# EAGLE design mainboard (EAGLE 5.09)

## Sheet 1 of 3
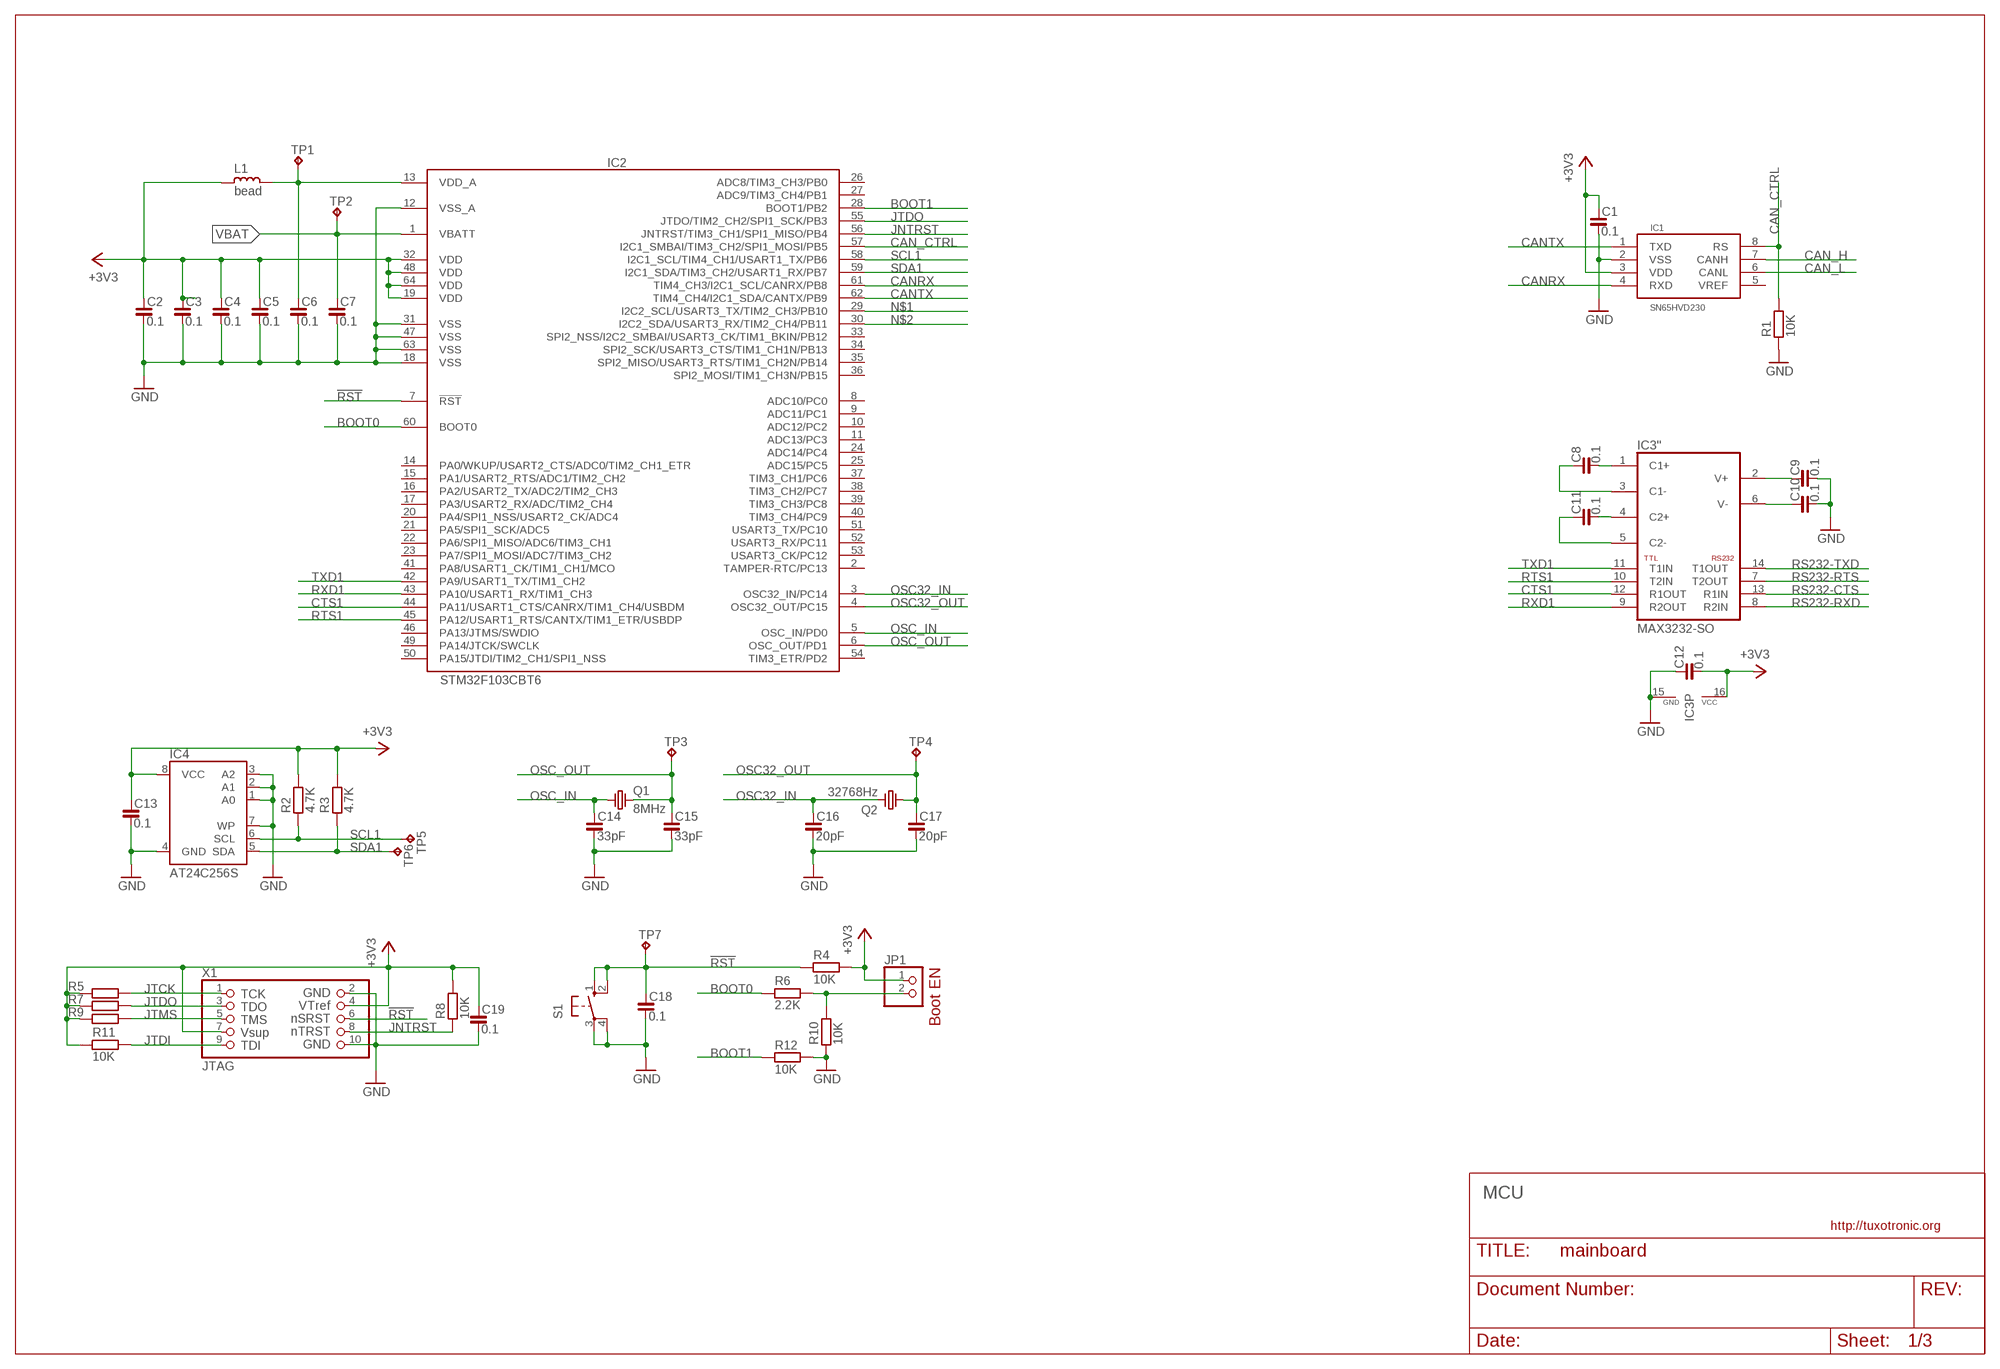
[diagram p0: schematic, sheet 1]

### Parts
C1  0.1  C_0603  [C0603]
C2  0.1  C_0603  [C0603]
C3  0.1  C_0603  [C0603]
C4  0.1  C_0603  [C0603]
C5  0.1  C_0603  [C0603]
C6  0.1  C_0603  [C0603]
C7  0.1  C_0603  [C0603]
C8  0.1  C_0603  [C0603]
C9  0.1  C_0603  [C0603]
C10  0.1  C_0603  [C0603]
C11  0.1  C_0603  [C0603]
C12  0.1  C_0603  [C0603]
C13  0.1  C_0603  [C0603]
C14  33pF  C_0603  [C0603]
C15  33pF  C_0603  [C0603]
C16  20pF  C_0603  [C0603]
C17  20pF  C_0603  [C0603]
C18  0.1  C_0603  [C0603]
C19  0.1  C_0603  [C0603]
IC1  SN65HVD230  [SO8]
IC2  STM32F103CBT6  STM32F10XRXT6  [TQFP64]
IC3  MAX3232-SO  MAX232-SO  [SO16]
IC4  AT24C256S  [SO08]
JP1  PINHD-1X2_2.00  [1X02M]
L1  bead  L_0603  [L0603]
Q1  8MHz  CRYSTAL-HC49S  [HC49/S]
Q2  32768Hz  CRYSTAL-TC38H  [TC38H]
R1  10K  R_0603  [R0603]
R2  4.7K  R_0603  [R0603]
R3  4.7K  R_0603  [R0603]
R4  10K  R_0603  [R0603]
R5  10K  R_0603  [R0603]
R6  2.2K  R_0603  [R0603]
R7  10K  R_0603  [R0603]
R8  10K  R_0603  [R0603]
R9  10K  R_0603  [R0603]
R10  10K  R_0603  [R0603]
R11  10K  R_0603  [R0603]
R12  10K  R_0603  [R0603]
S1  10-XX  [B3F-10XX]
TP1  TPB1,27  [B1,27]
TP2  TPB1,27  [B1,27]
TP3  TPB1,27  [B1,27]
TP4  TPB1,27  [B1,27]
TP5  TPB1,27  [B1,27]
TP6  TPB1,27  [B1,27]
TP7  TPB1,27  [B1,27]
X1  JTAG  JTAG10_2.00  [2X05M-JTAG]

### Nets
!RST: C18.1 IC2.7(!RST) R4.1 S1.1(S) S1.2(S1) TP7.PP(TP) X1.6
+3V3: C1.1 C2.1 C3.1 C4.1 C5.1 C12.2 C13.1 C19.1 IC1.3(VDD) IC2.19(VDD) IC2.32(VDD) IC2.48(VDD) IC2.64(VDD) IC3.16(P:VCC) IC4.8(VCC) JP1.1 L1.2 R2.2 R3.2 R4.2 R5.1 R7.1 R8.2 R9.1 R11.1 X1.4 X1.7 ; also sheet 2
BOOT0: IC2.60(BOOT0) R6.1
BOOT1: IC2.28(BOOT1/PB2) R12.1
CAN_CTRL: IC1.8(RS) IC2.57(I2C1_SMBAI/TIM3_CH2/SPI1_MOSI/PB5) R1.2
CAN_H: IC1.7(CANH) ; also sheet 2
CAN_L: IC1.6(CANL) ; also sheet 2
CANRX: IC1.4(RXD) IC2.61(TIM4_CH3/I2C1_SCL/CANRX/PB8)
CANTX: IC1.1(TXD) IC2.62(TIM4_CH4/I2C1_SDA/CANTX/PB9)
CTS1: IC2.44(PA11/USART1_CTS/CANRX/TIM1_CH4/USBDM) IC3.12('':R1OUT)
GND: C1.2 C2.2 C3.2 C4.2 C5.2 C6.2 C7.2 C9.2 C10.2 C12.1 C13.2 C14.2 C15.2 C16.2 C17.2 C18.2 C19.2 IC1.2(VSS) IC2.12(VSS_A) IC2.18(VSS) IC2.31(VSS) IC2.47(VSS) IC2.63(VSS) IC3.15(P:GND) IC4.1(A0) IC4.2(A1) IC4.3(A2) IC4.4(GND) IC4.7(WP) R1.1 R10.1 R12.2 S1.3(P) S1.4(P1) X1.2 X1.10 ; also sheet 2,3
JNTRST: IC2.56(JNTRST/TIM3_CH1/SPI1_MISO/PB4) R8.1 X1.8
JTCK: R5.2 X1.1
JTDI: R11.2 X1.9
JTDO: IC2.55(JTDO/TIM2_CH2/SPI1_SCK/PB3) R7.2 X1.3
JTMS: R9.2 X1.5
N$1: IC2.29(I2C2_SCL/USART3_TX/TIM2_CH3/PB10)
N$2: IC2.30(I2C2_SDA/USART3_RX/TIM2_CH4/PB11)
N$44: JP1.2 R6.2 R10.2
N$80: C9.1 IC3.2('':V+)
N$81: C10.1 IC3.6('':V-)
N$82: C11.1 IC3.5('':C2-)
N$83: C11.2 IC3.4('':C2+)
N$84: C8.1 IC3.3('':C1-)
N$85: C8.2 IC3.1('':C1+)
OSC32_IN: C16.1 IC2.3(OSC32_IN/PC14) Q2.2
OSC32_OUT: C17.1 IC2.4(OSC32_OUT/PC15) Q2.1 TP4.PP(TP)
OSC_IN: C14.1 IC2.5(OSC_IN/PD0) Q1.1
OSC_OUT: C15.1 IC2.6(OSC_OUT/PD1) Q1.2 TP3.PP(TP)
RS232-CTS: IC3.13('':R1IN) ; also sheet 2
RS232-RTS: IC3.7('':T2OUT) ; also sheet 2
RS232-RXD: IC3.8('':R2IN) ; also sheet 2
RS232-TXD: IC3.14('':T1OUT) ; also sheet 2
RTS1: IC2.45(PA12/USART1_RTS/CANTX/TIM1_ETR/USBDP) IC3.10('':T2IN)
RXD1: IC2.43(PA10/USART1_RX/TIM1_CH3) IC3.9('':R2OUT)
SCL1: IC2.58(I2C1_SCL/TIM4_CH1/USART1_TX/PB6) IC4.6(SCL) R2.1 TP5.PP(TP)
SDA1: IC2.59(I2C1_SDA/TIM3_CH2/USART1_RX/PB7) IC4.5(SDA) R3.1 TP6.PP(TP)
TXD1: IC2.42(PA9/USART1_TX/TIM1_CH2) IC3.11('':T1IN)
VBAT: C7.1 IC2.1(VBATT) TP2.PP(TP)
VDDA: C6.1 IC2.13(VDD_A) L1.1 TP1.PP(TP)
Unconnected: IC1.5(VREF) IC2.2(TAMPER-RTC/PC13) IC2.8(ADC10/PC0) IC2.9(ADC11/PC1) IC2.10(ADC12/PC2) IC2.11(ADC13/PC3) IC2.14(PA0/WKUP/USART2_CTS/ADC0/TIM2_CH1_ETR) IC2.15(PA1/USART2_RTS/ADC1/TIM2_CH2) IC2.16(PA2/USART2_TX/ADC2/TIM2_CH3) IC2.17(PA3/USART2_RX/ADC/TIM2_CH4) IC2.20(PA4/SPI1_NSS/USART2_CK/ADC4) IC2.21(PA5/SPI1_SCK/ADC5) IC2.22(PA6/SPI1_MISO/ADC6/TIM3_CH1) IC2.23(PA7/SPI1_MOSI/ADC7/TIM3_CH2) IC2.24(ADC14/PC4) IC2.25(ADC15/PC5) IC2.26(ADC8/TIM3_CH3/PB0) IC2.27(ADC9/TIM3_CH4/PB1) IC2.33(SPI2_NSS/I2C2_SMBAI/USART3_CK/TIM1_BKIN/PB12) IC2.34(SPI2_SCK/USART3_CTS/TIM1_CH1N/PB13) IC2.35(SPI2_MISO/USART3_RTS/TIM1_CH2N/PB14) IC2.36(SPI2_MOSI/TIM1_CH3N/PB15) IC2.37(TIM3_CH1/PC6) IC2.38(TIM3_CH2/PC7) IC2.39(TIM3_CH3/PC8) IC2.40(TIM3_CH4/PC9) IC2.41(PA8/USART1_CK/TIM1_CH1/MCO) IC2.46(PA13/JTMS/SWDIO) IC2.49(PA14/JTCK/SWCLK) IC2.50(PA15/JTDI/TIM2_CH1/SPI1_NSS) IC2.51(USART3_TX/PC10) IC2.52(USART3_RX/PC11) IC2.53(USART3_CK/PC12) IC2.54(TIM3_ETR/PD2)

### Notes on the sheet
- Boot EN
- MCU

## Sheet 2 of 3
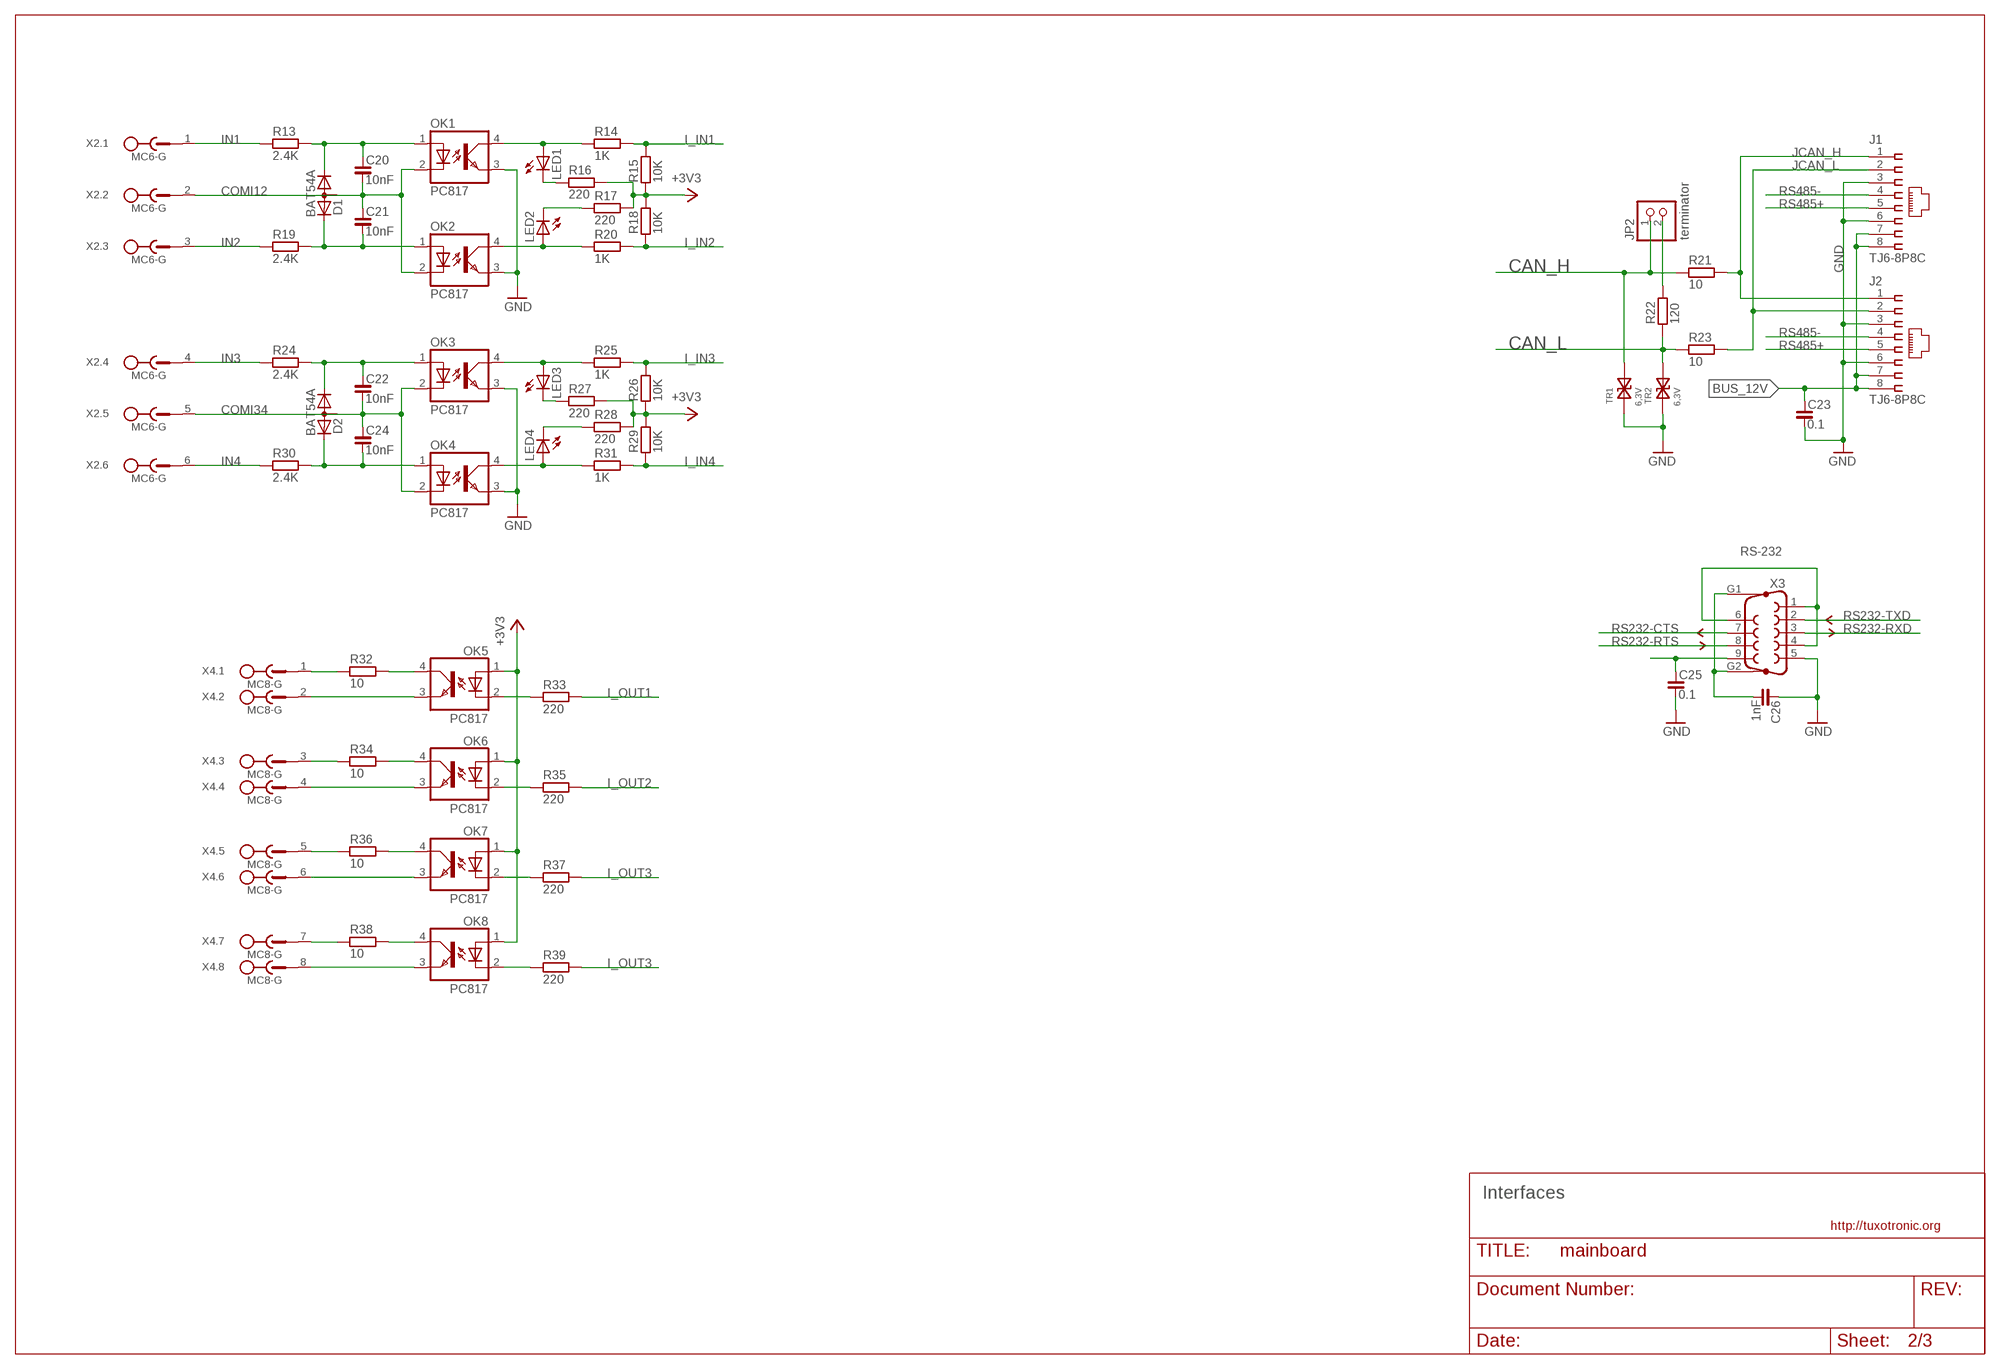
[diagram p1: schematic, sheet 2]

### Parts
C20  10nF  C_0603  [C0603]
C21  10nF  C_0603  [C0603]
C22  10nF  C_0603  [C0603]
C23  0.1  C_0805  [C0805]
C24  10nF  C_0603  [C0603]
C25  0.1  C_0805  [C0805]
C26  1nF  C_1206  [C1206]
D1  BAT54A  DIODE_CA-AC__  [SOT23C]
D2  BAT54A  DIODE_CA-AC__  [SOT23C]
J1  TJ6-8P8C  8P8C-PS  [520251-4]
J2  TJ6-8P8C  8P8C-PS  [520251-4]
JP2  terminator  PINHD-1X2_2.00  [1X02M]
LED1  LEDCHIP-LED0805  [CHIP-LED0805]
LED2  LEDCHIP-LED0805  [CHIP-LED0805]
LED3  LEDCHIP-LED0805  [CHIP-LED0805]
LED4  LEDCHIP-LED0805  [CHIP-LED0805]
OK1  PC817  [DIL04]
OK2  PC817  [DIL04]
OK3  PC817  [DIL04]
OK4  PC817  [DIL04]
OK5  PC817  [DIL04]
OK6  PC817  [DIL04]
OK7  PC817  [DIL04]
OK8  PC817  [DIL04]
R13  2.4K  R_0603  [R0603]
R14  1K  R_0603  [R0603]
R15  10K  R_0603  [R0603]
R16  220  R_0603  [R0603]
R17  220  R_0603  [R0603]
R18  10K  R_0603  [R0603]
R19  2.4K  R_0603  [R0603]
R20  1K  R_0603  [R0603]
R21  10  R_0603  [R0603]
R22  120  R_0603  [R0603]
R23  10  R_0603  [R0603]
R24  2.4K  R_0603  [R0603]
R25  1K  R_0603  [R0603]
R26  10K  R_0603  [R0603]
R27  220  R_0603  [R0603]
R28  220  R_0603  [R0603]
R29  10K  R_0603  [R0603]
R30  2.4K  R_0603  [R0603]
R31  1K  R_0603  [R0603]
R32  10  R_0805  [R0805]
R33  220  R_0603  [R0603]
R34  10  R_0805  [R0805]
R35  220  R_0603  [R0603]
R36  10  R_0805  [R0805]
R37  220  R_0603  [R0603]
R38  10  R_0805  [R0805]
R39  220  R_0603  [R0603]
TR1  6,3V  TRANSIL-SMB  [SMB]
TR2  6,3V  TRANSIL-SMB  [SMB]
X2  MC6-G  [MC6-G]
X3  F09HP-9.4  [F09HP]
X4  MC8-G  [MC8-G]

### Nets
+3V3: OK5.1(A) OK6.1(A) OK7.1(A) OK8.1(A) R15.1 R16.2 R17.2 R18.2 R26.1 R27.2 R28.2 R29.2 ; also sheet 1
BUS_12V: C23.1 J1.7 J1.8 J2.7 J2.8 ; also sheet 3
CAN_H: JP2.1 R21.1 TR1.C ; also sheet 1
CAN_L: R22.1 R23.1 TR2.C ; also sheet 1
COMI12: C20.2 C21.1 D1.3(A) OK1.2(C) OK2.2(C) X2.2
COMI34: C22.2 C24.1 D2.3(A) OK3.2(C) OK4.2(C) X2.5
GND: C23.2 C25.2 C26.1 J1.3 J1.6 J2.3 J2.6 OK1.3(EMIT) OK2.3(EMIT) OK3.3(EMIT) OK4.3(EMIT) TR1.A TR2.A X3.5 ; also sheet 1,3
I_IN1: R14.2 R15.2
I_IN2: R18.1 R20.2
I_IN3: R25.2 R26.2
I_IN4: R29.1 R31.2
I_OUT1: R33.2
I_OUT2: R35.2
I_OUT3: R37.2 R39.2
IN1: R13.1 X2.1
IN2: R19.1 X2.3
IN3: R24.1 X2.4
IN4: R30.1 X2.6
JCAN_H: J1.1 J2.1 R21.2
JCAN_L: J1.2 J2.2 R23.2
N$3: LED1.A OK1.4(COL) R14.1
N$4: C20.1 D1.1(K1) OK1.1(A) R13.2
N$5: LED2.A OK2.4(COL) R20.1
N$6: C21.2 D1.2(K2) OK2.1(A) R19.2
N$7: LED3.A OK3.4(COL) R25.1
N$8: JP2.2 R22.2
N$9: C22.1 D2.1(K1) OK3.1(A) R24.2
N$10: LED4.A OK4.4(COL) R31.1
N$11: C24.2 D2.2(K2) OK4.1(A) R30.2
N$12: LED3.C R27.1
N$13: LED4.C R28.1
N$19: X3.1 X3.4 X3.6
N$22: OK5.3(EMIT) X4.2
N$23: R32.1 X4.1
N$24: OK5.4(COL) R32.2
N$25: OK6.4(COL) R34.2
N$26: OK6.3(EMIT) X4.4
N$27: R34.1 X4.3
N$28: OK7.3(EMIT) X4.6
N$29: R36.1 X4.5
N$30: OK7.4(COL) R36.2
N$31: R38.1 X4.7
N$32: OK5.2(C) R33.1
N$33: OK6.2(C) R35.1
N$34: OK7.2(C) R37.1
N$35: OK8.3(EMIT) X4.8
N$36: OK8.4(COL) R38.2
N$37: OK8.2(C) R39.1
N$38: C26.2 X3.G1 X3.G2
N$39: C25.1 X3.9
N$57: LED1.C R16.1
N$58: LED2.C R17.1
RS232-CTS: X3.7 ; also sheet 1
RS232-RTS: X3.8 ; also sheet 1
RS232-RXD: X3.3 ; also sheet 1
RS232-TXD: X3.2 ; also sheet 1
RS485+: J1.5 J2.5
RS485-: J1.4 J2.4

### Notes on the sheet
- RS-232
- Interfaces

## Sheet 3 of 3
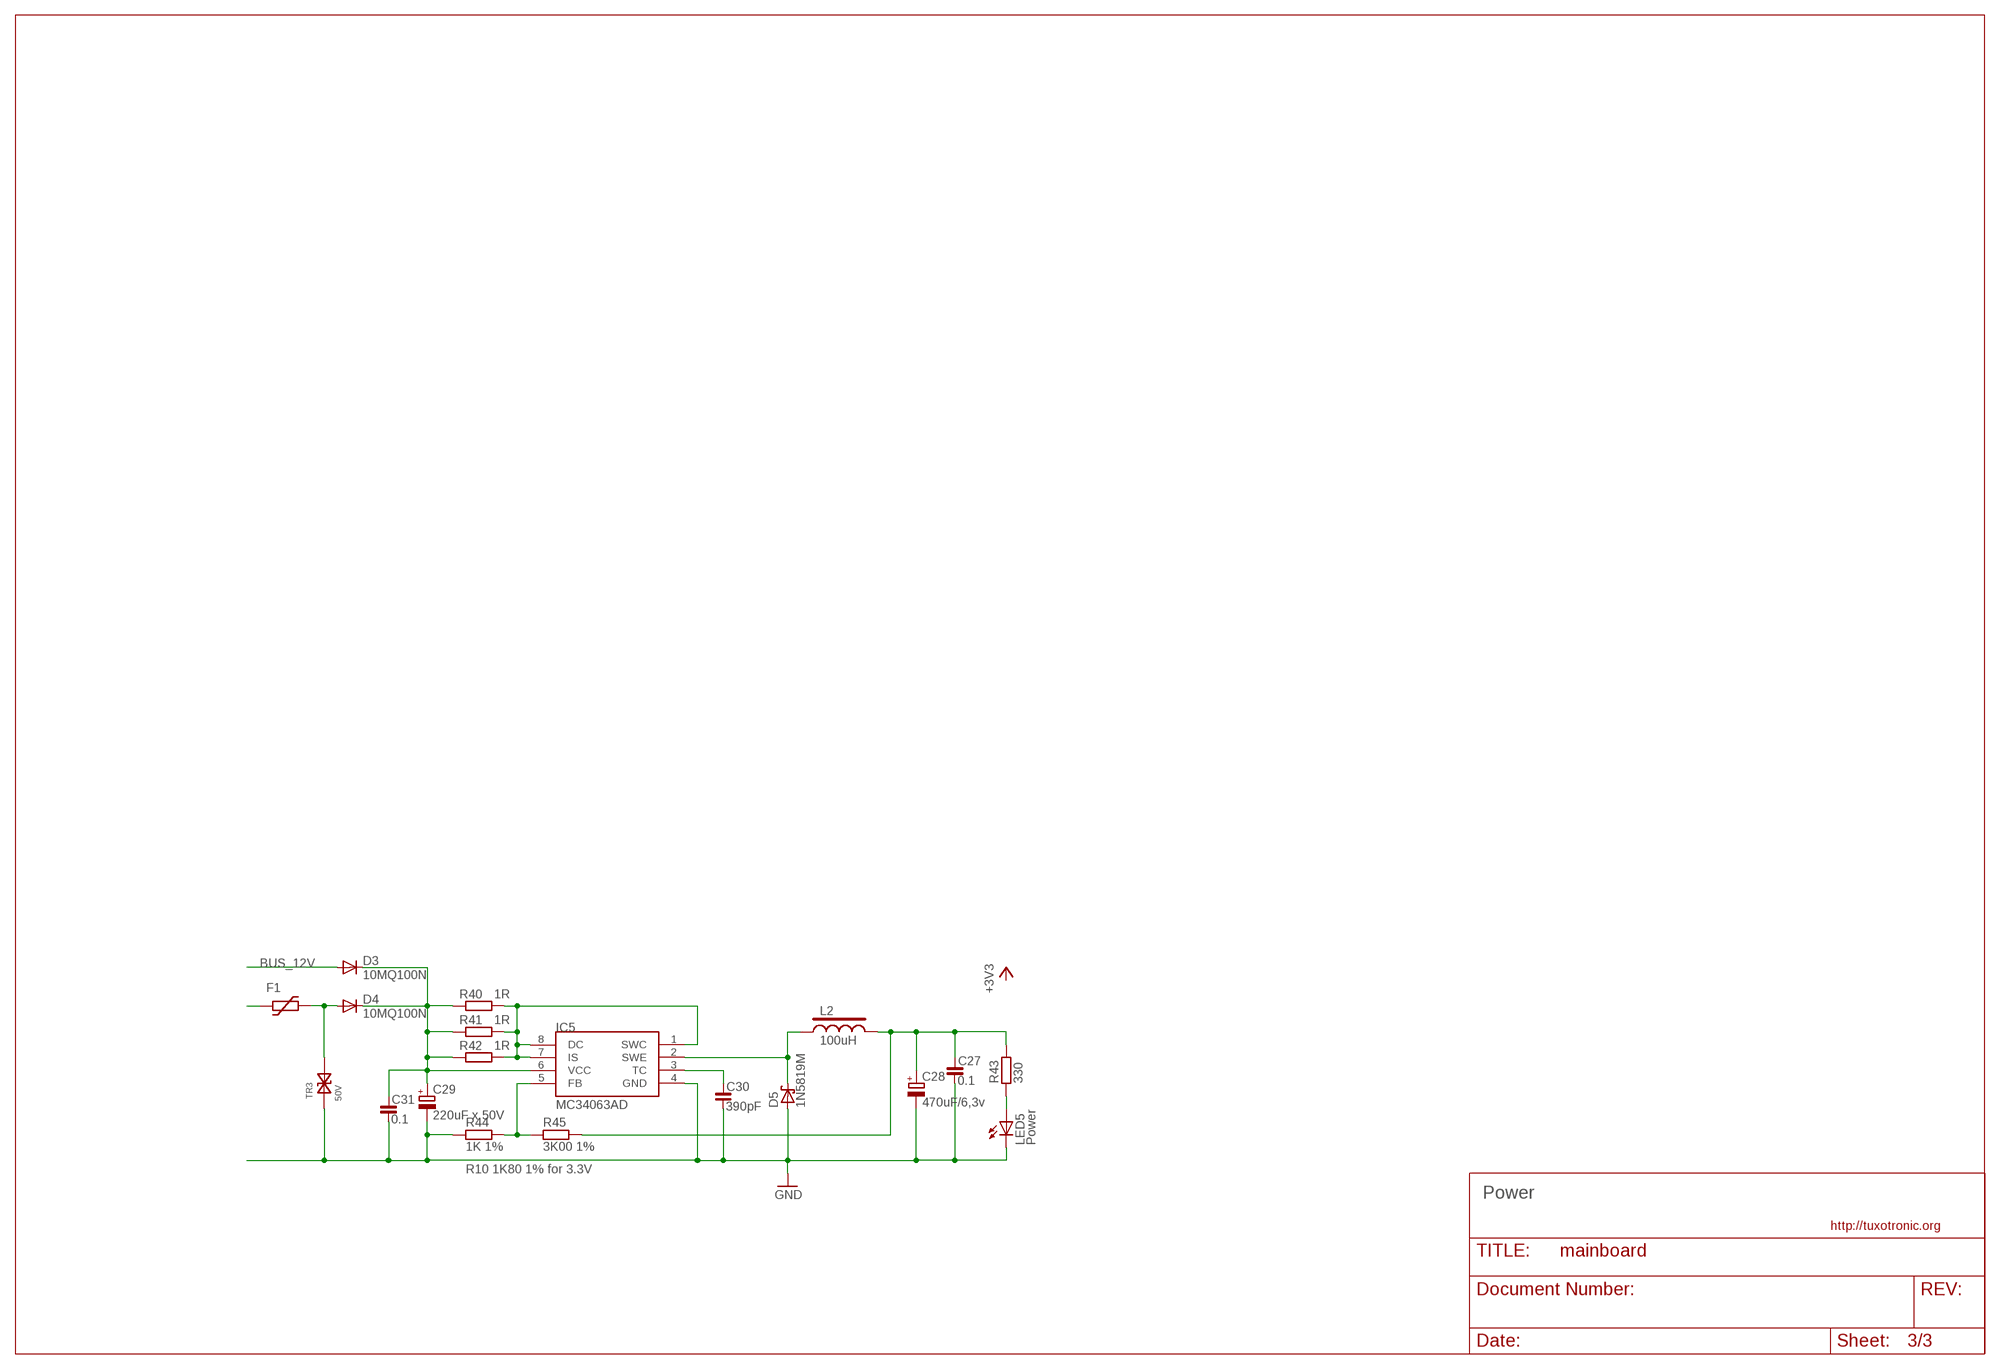
[diagram p2: schematic, sheet 3]

### Parts
C27  0.1  C_0805  [C0805]
C28  470uF/6,3v  CPOL-E3.5-8  [E3,5-8]
C29  220uF x 50V  CPOL-E3.5-8  [E3,5-8]
C30  390pF  C_0603  [C0603]
C31  0.1  C_0805  [C0805]
D3  10MQ100N  DIODE-SMB  [SMB]
D4  10MQ100N  DIODE-SMB  [SMB]
D5  1N5819M  SCHOTTKY-MELF  [MELF-MLL41]
F1  1812L  [1812L]
IC5  MC34063AD  [SOIC8]
L2  100uH  L-RCH895  [RCH895]
LED5  Power  LED3MM  [LED3MM]
R40  1R  R_0805  [R0805]
R41  1R  R_0805  [R0805]
R42  1R  R_0805  [R0805]
R43  330  R_0603  [R0603]
R44  1K 1%  R_0603  [R0603]
R45  3K00 1%  R_0603  [R0603]
TR3  50V  TRANSIL-SMB  [SMB]

### Nets
BUS_12V: D3.A ; also sheet 2
GND: C27.2 C28.- C29.- C30.2 C31.2 D5.A IC5.4(GND) LED5.K(C) R44.1 TR3.A ; also sheet 1,2
N$14: C30.1 IC5.3(TC)
N$15: D5.C IC5.2(SWE) L2.1
N$16: IC5.5(FB) R44.2 R45.1
N$17: IC5.1(SWC) IC5.7(IS) IC5.8(DC) R40.2 R41.2 R42.2
N$18: D4.A F1.P$2 TR3.C
N$20: F1.P$1
N$21: LED5.A R43.1
N$40: C27.1 C28.+ L2.2 R43.2 R45.2
VPOW: C29.+ C31.1 D3.C D4.C IC5.6(VCC) R40.1 R41.1 R42.1

### Notes on the sheet
- R10 1K80 1% for 3.3V
- Power

## Library data of the parts
C1-C27 C30 C31 = rc-master-smd:C_: NON-POLARIZED CAP
C28 C29 = rs485:CPOL-: POLARIZED CAPACITOR, European symbol
D1 D2 = semicon-smd-ipc:DIODE_CA-AC_: DUAL DIODE
D3 D4 = rs485:DIODE-: DIODE
D5 = rs485:SCHOTTKY-: Schottky Diode
F1 = discrete:1812L
IC1 = can-phy:SN65HVD230: CAN PHY driver
IC2 = mylib:STM32F10XRXT6: STM32F101/103 64pin LQFP
IC3 = rs232-rs485:MAX232: RS232 TRANSEIVER
IC4 = stm32-by-pb:AT24C*: 2-wire serial EEPROM
IC5 = rs485:MC34063: 1.5 A, Step-Up/Down/Inverting Switching Regulator
J1 J2 = modular-jack:8P8C: 8P8C (RJ-45) modular jack connector
JP1 = pinhead-fixdrills:PINHD-1X2: PIN HEADER
JP2 = pinhead-1:PINHD-1X2: PIN HEADER
L1 = rc-master-smd:L_: INDUCTOR
L2 = discrete:L-: Inductors
LED1-LED4 = led:LED: LED OSRAM: - CHIPLED LG R971, LG N971, LY N971, LG Q971, LY Q971, LO R971, LY R971 LH N974, LH R974 LS Q976, LO Q976, LY Q976 LO Q996 - Hyper CHIPLED LW Q18S LB Q993, LB Q99A, LB R99A - SideLED LS A670, LO A670, LY A670, LG A670, LP A670 LB A673, LV A673, LT A673, LW A673 LH A674 LY A675 LS A676, LA A676, LO A676, LY A676, LW A676 LS A679, LY A679, LG A679 - Hyper Micro SIDELED® LS Y876, LA Y876, LO Y876, LY Y876 LT Y87S - SmartLED LW L88C, LW L88S LB L89C, LB L89S, LG L890 LS L89K, LO L89K, LY L89K LS L896, LA L896, LO L896, LY L896 - TOPLED LS T670, LO T670, LY T670, LG T670, LP T670 LSG T670, LSP T670, LSY T670, LOP T670, LYG T670 LG T671, LOG T671, LSG T671 LB T673, LV T673, LT T673, LW T673 LH T674 LS T676, LA T676, LO T676, LY T676, LB T676, LH T676, LSB T676, LW T676 LB T67C, LV T67C, LT T67C, LS T67K, LO T67K, LY T67K, LW E67C LS E67B, LA E67B, LO E67B, LY E67B, LB E67C, LV E67C, LT E67C LW T67C LS T679, LY T679, LG T679 LS T770, LO T770, LY T770, LG T770, LP T770 LB T773, LV T773, LT T773, LW T773 LH T774 LS E675, LA E675, LY E675, LS T675 LS T776, LA T776, LO T776, LY T776, LB T776 LHGB T686 LT T68C, LB T68C - Hyper Mini TOPLED® LB M676 - Mini TOPLED Santana® LG M470 LS M47K, LO M47K, LY M47K Source: http://www.osram.convergy.de - LUMILED® LXK2-PW12-R00, LXK2-PW12-S00, LXK2-PW14-U00, LXK2-PW14-V00 LXK2-PM12-R00, LXK2-PM12-S00, LXK2-PM14-U00 LXK2-PE12-Q00, LXK2-PE12-R00, LXK2-PE12-S00, LXK2-PE14-T00, LXK2-PE14-U00 LXK2-PB12-K00, LXK2-PB12-L00, LXK2-PB12-M00, LXK2-PB14-N00, LXK2-PB14-P00, LXK2-PB14-Q00 LXK2-PR12-L00, LXK2-PR12-M00, LXK2-PR14-Q00, LXK2-PR14-R00 LXK2-PD12-Q00, LXK2-PD12-R00, LXK2-PD12-S00 LXK2-PH12-R00, LXK2-PH12-S00 LXK2-PL12-P00, LXK2-PL12-Q00, LXK2-PL12-R00 Source: www.luxeon.com
LED5 = rs485:LED: LED OSRAM: - CHIPLED LG R971, LG N971, LY N971, LG Q971, LY Q971, LO R971, LY R971 LH N974, LH R974 LS Q976, LO Q976, LY Q976 LO Q996 - Hyper CHIPLED LW Q18S LB Q993, LB Q99A, LB R99A - SideLED LS A670, LO A670, LY A670, LG A670, LP A670 LB A673, LV A673, LT A673, LW A673 LH A674 LY A675 LS A676, LA A676, LO A676, LY A676, LW A676 LS A679, LY A679, LG A679 - Hyper Micro SIDELED® LS Y876, LA Y876, LO Y876, LY Y876 LT Y87S - SmartLED LW L88C, LW L88S LB L89C, LB L89S, LG L890 LS L89K, LO L89K, LY L89K LS L896, LA L896, LO L896, LY L896 - TOPLED LS T670, LO T670, LY T670, LG T670, LP T670 LSG T670, LSP T670, LSY T670, LOP T670, LYG T670 LG T671, LOG T671, LSG T671 LB T673, LV T673, LT T673, LW T673 LH T674 LS T676, LA T676, LO T676, LY T676, LB T676, LH T676, LSB T676, LW T676 LB T67C, LV T67C, LT T67C, LS T67K, LO T67K, LY T67K, LW E67C LS E67B, LA E67B, LO E67B, LY E67B, LB E67C, LV E67C, LT E67C LW T67C LS T679, LY T679, LG T679 LS T770, LO T770, LY T770, LG T770, LP T770 LB T773, LV T773, LT T773, LW T773 LH T774 LS E675, LA E675, LY E675, LS T675 LS T776, LA T776, LO T776, LY T776, LB T776 LHGB T686 LT T68C, LB T68C - Hyper Mini TOPLED® LB M676 - Mini TOPLED Santana® LG M470 LS M47K, LO M47K, LY M47K Source: http://www.osram.convergy.de - LUMILED® LXK2-PW12-R00, LXK2-PW12-S00, LXK2-PW14-U00, LXK2-PW14-V00 LXK2-PM12-R00, LXK2-PM12-S00, LXK2-PM14-U00 LXK2-PE12-Q00, LXK2-PE12-R00, LXK2-PE12-S00, LXK2-PE14-T00, LXK2-PE14-U00 LXK2-PB12-K00, LXK2-PB12-L00, LXK2-PB12-M00, LXK2-PB14-N00, LXK2-PB14-P00, LXK2-PB14-Q00 LXK2-PR12-L00, LXK2-PR12-M00, LXK2-PR14-Q00, LXK2-PR14-R00 LXK2-PD12-Q00, LXK2-PD12-R00, LXK2-PD12-S00 LXK2-PH12-R00, LXK2-PH12-S00 LXK2-PL12-P00, LXK2-PL12-Q00, LXK2-PL12-R00 Source: www.luxeon.com
OK1-OK8 = some:PC817: SHARP OPTO COUPLER
Q1 Q2 = crystal:CRYSTAL-: CRYSTAL
R1-R45 = rc-master-smd:R_: RESISTOR
S1 = buttons:10-XX: OMRON SWITCH
TP1-TP7 = testpad:TP: Test pad
TR1-TR3 = rs485:TRANSIL-: Transil BIDIR.
X1 = jtag:JTAG10: 10 pin JTAG connector http://www.ethernut.de/en/hardware/enut3/jtag.html
X2 = con-phoenix-381_l:MC6-G: Mini-Combicon 3.81mm horizontal 6-polig (mit Gegenstecker)
X3 = sub-d:F09HP: SUB-D
X4 = con-phoenix-381_l:MC8-G: Mini-Combicon 3.81mm horizontal 8-polig (mit Gegenstecker)

## Board
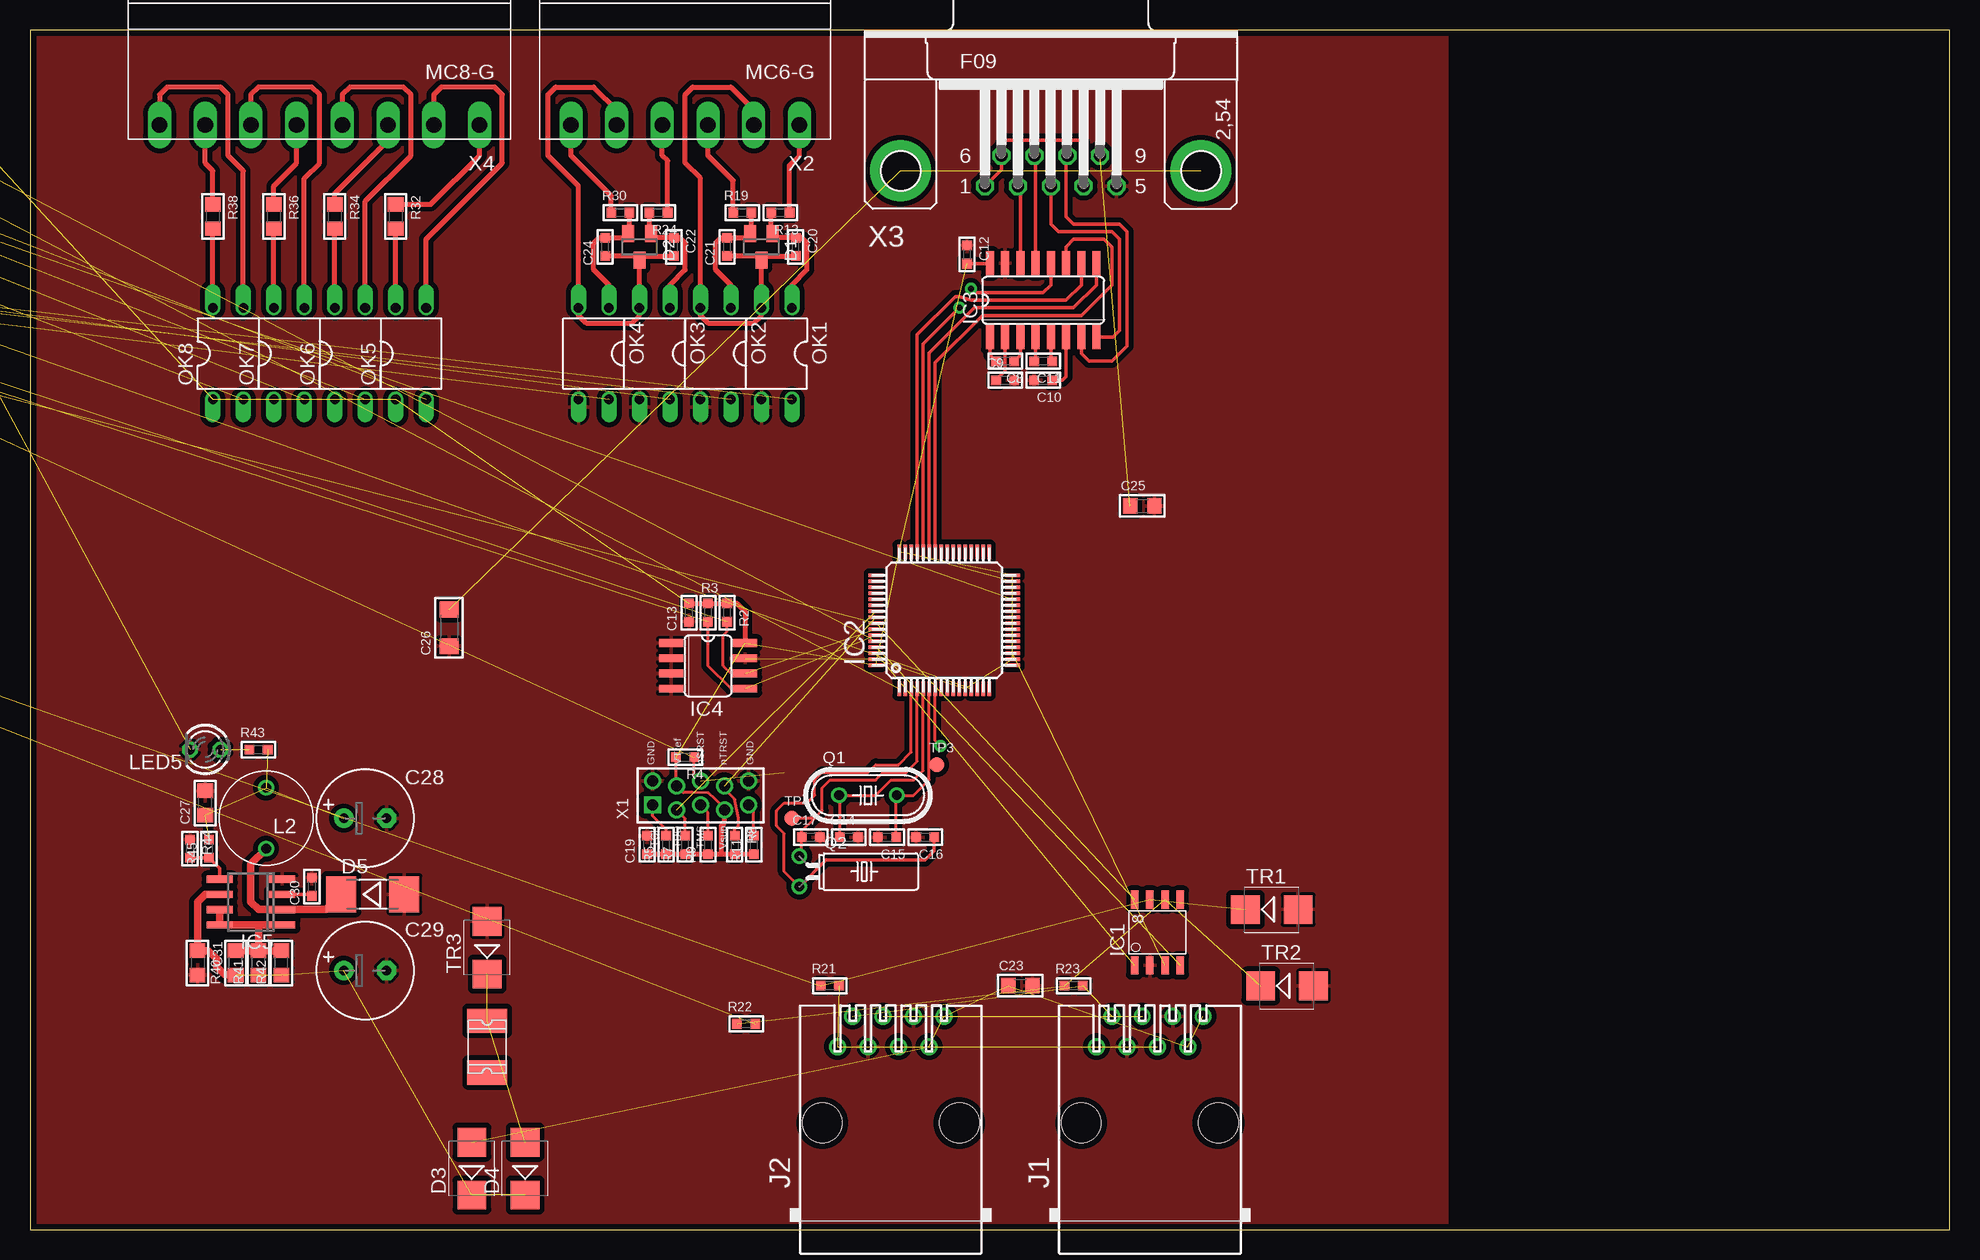
[diagram p3: board, top side]
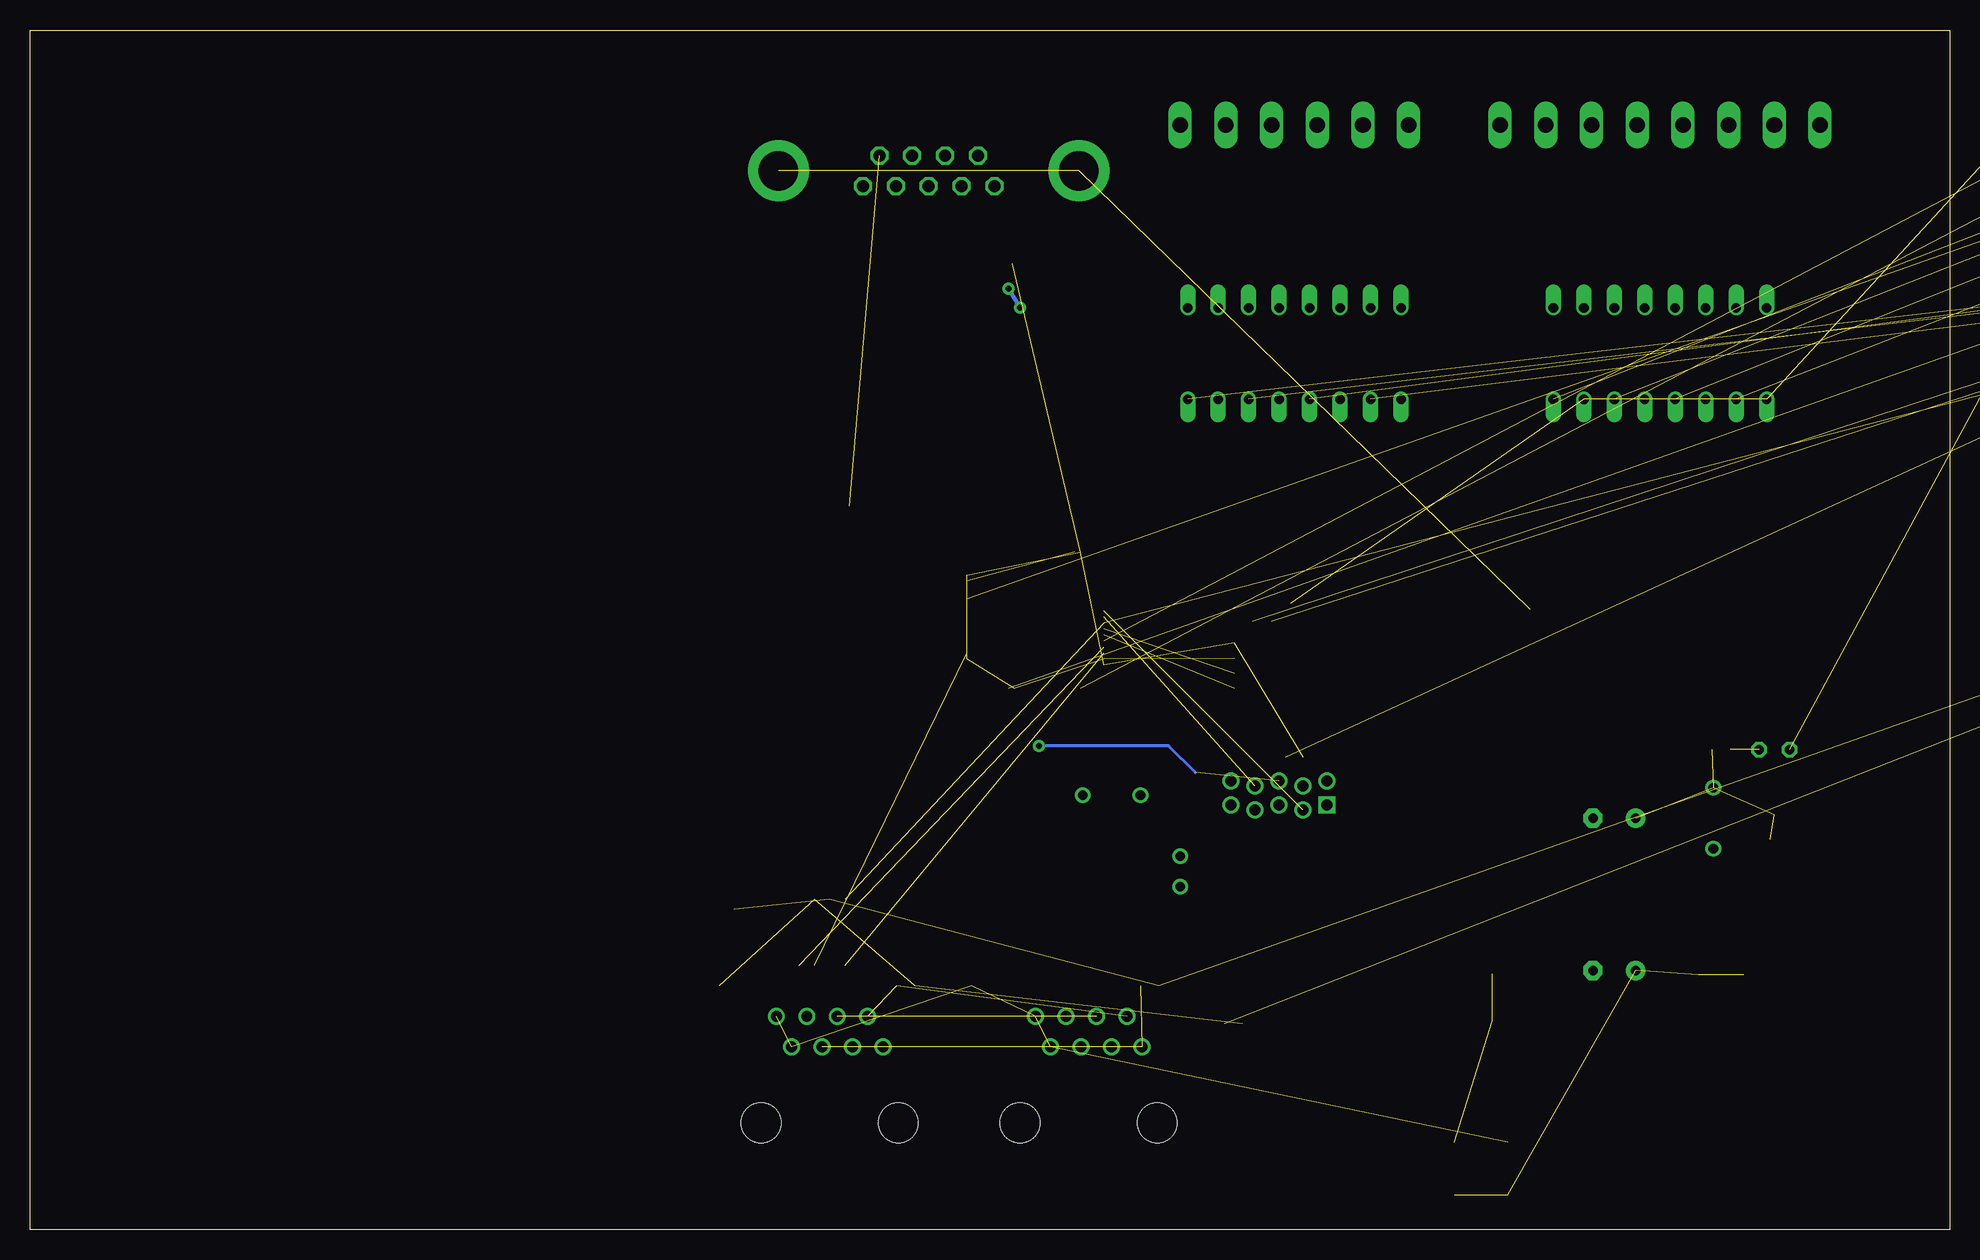
[diagram p4: board, bottom side, seen from below]

Size 160 x 100 mm. Coordinates in mm from the lower left corner, seen from the top.
Outline: 0,0 160,0 160,100 0,100 0,0
Copper layers (1*16): Top 0.018mm / dielectric 1.5011mm / Bottom 0.018mm
Design rules "resonit-speed-18mkm *": minimum track width 0.2mm, minimum drill 0.5mm, track to track 0.151mm, track to pad 0.151mm, pad to pad 0.151mm, via to via 0.151mm, smd to smd 0.151mm, copper to edge 0.5mm, drill to drill 8mil, minimum pad ring 0.2489mm, minimum via ring 0.2489mm, stop-mask expansion 4mil, vias tented up to drill 0.5994mm, thermal gap 10mil

### Footprints (pad centres in the part's own frame; a part is rotated, then mirrored left to right if it is on the bottom)
C0603 = smd 0.8 x 0.8: 1 -0.762,0; 2 0.762,0
C0805 = smd 1.2 x 1.3: 1 -1.016,0; 2 1.016,0
C1206 = smd 1.3 x 1.6: 1 -1.524,0; 2 1.524,0
E3,5-8 = drill 0.813 pad 1.6 round: + -1.778,0 | drill 0.813 pad 1.6 octagon: - 1.778,0
SOT23C = smd 1 x 1.4: 1 -0.95,-1.1; 2 0.95,-1.1; 3 0,1.1
SMB = smd 2.4 x 2.4: A 2.2,0; C -2.2,0
MELF-MLL41 = smd 2.5 x 3: A 2.625,0; C -2.625,0
1812L = smd 2.03 x 3.3: P$1 -2.16,0; P$2 2.16,0
SO8 = smd 0.61 x 1.524: 1 -1.27,-2.743; 2 0,-2.743; 3 1.27,-2.743; 4 2.54,-2.743; 5 2.54,2.743; 6 1.27,2.743; 7 0,2.743; 8 -1.27,2.743
TQFP64 = smd 1.2 x 0.3: 1 -5.7,3.75; 2 -5.7,3.25; 3 -5.7,2.75; 4 -5.7,2.25; 5 -5.7,1.75; 6 -5.7,1.25; 7 -5.7,0.75; 8 -5.7,0.25; 9 -5.7,-0.25; 10 -5.7,-0.75; 11 -5.7,-1.25; 12 -5.7,-1.75; 13 -5.7,-2.25; 14 -5.7,-2.75; 15 -5.7,-3.25; 16 -5.7,-3.75; 33 5.7,-3.75; 34 5.7,-3.25; 35 5.7,-2.75; 36 5.7,-2.25; 37 5.7,-1.75; 38 5.7,-1.25; 39 5.7,-0.75; 40 5.7,-0.25; 41 5.7,0.25; 42 5.7,0.75; 43 5.7,1.25; 44 5.7,1.75; 45 5.7,2.25; 46 5.7,2.75; 47 5.7,3.25; 48 5.7,3.75 | smd 0.3 x 1.2: 17 -3.75,-5.7; 18 -3.25,-5.7; 19 -2.75,-5.7; 20 -2.25,-5.7; 21 -1.75,-5.7; 22 -1.25,-5.7; 23 -0.75,-5.7; 24 -0.25,-5.7; 25 0.25,-5.7; 26 0.75,-5.7; 27 1.25,-5.7; 28 1.75,-5.7; 29 2.25,-5.7; 30 2.75,-5.7; 31 3.25,-5.7; 32 3.75,-5.7; 49 3.75,5.7; 50 3.25,5.7; 51 2.75,5.7; 52 2.25,5.7; 53 1.75,5.7; 54 1.25,5.7; 55 0.75,5.7; 56 0.25,5.7; 57 -0.25,5.7; 58 -0.75,5.7; 59 -1.25,5.7; 60 -1.75,5.7; 61 -2.25,5.7; 62 -2.75,5.7; 63 -3.25,5.7; 64 -3.75,5.7
SO16 = smd 0.66 x 2.032: 1 -4.445,-3.073; 2 -3.175,-3.073; 3 -1.905,-3.073; 4 -0.635,-3.073; 5 0.635,-3.073; 6 1.905,-3.073; 7 3.175,-3.073; 8 4.445,-3.073; 9 4.445,3.073; 10 3.175,3.073; 11 1.905,3.073; 12 0.635,3.073; 13 -0.635,3.073; 14 -1.905,3.073; 15 -3.175,3.073; 16 -4.445,3.073
SO08 = smd 0.66 x 2.032: 1 -1.905,-3.073; 2 -0.635,-3.073; 3 0.635,-3.073; 4 1.905,-3.073; 5 1.905,3.073; 6 0.635,3.073; 7 -0.635,3.073; 8 -1.905,3.073
SOIC8 = smd 0.6 x 2.2: 1 -1.905,-2.6; 2 -0.635,-2.6; 3 0.635,-2.6; 4 1.905,-2.6; 5 1.905,2.6; 6 0.635,2.6; 7 -0.635,2.6; 8 -1.905,2.6
520251-4 = drill 0.914 round: 1 -4.445,7.62; 2 -3.175,10.16; 3 -1.905,7.62; 4 -0.635,10.16; 5 0.635,7.62; 6 1.905,10.16; 7 3.175,7.62; 8 4.445,10.16 | hole 3.302: -5.715,1.27; 5.715,1.27
1X02M = drill 0.9 square: 1 -1,0 | drill 0.9 round: 2 1,0
1X02M' = drill 0.914 square: 1 -1,0 | drill 0.914 round: 2 1,0
L0603 = smd 0.8 x 0.8: 1 -0.762,0; 2 0.762,0
RCH895 = drill 0.813 round: 1 0,2.54; 2 0,-2.54
CHIP-LED0805 = smd 1.2 x 1.2: A 0,-1.05; C 0,1.05
LED3MM = drill 0.813 octagon: A -1.27,0; K 1.27,0
DIL04 = drill 0.8 offset: 1 -1.27,-3.81; 2 1.27,-3.81; 3 1.27,3.81; 4 -1.27,3.81
HC49/S = drill 0.8 round: 1 -2.413,0; 2 2.413,0
TC38H = drill 0.8 round: 1 -1.27,0; 2 1.27,0
R0603 = smd 0.8 x 0.8: 1 -0.762,0; 2 0.762,0
R0805 = smd 1.2 x 1.3: 1 -1.016,0; 2 1.016,0
B3F-10XX = drill 1.016 long: 1 -3.251,2.261; 2 3.251,2.261; 3 -3.251,-2.261; 4 3.251,-2.261
B1,27 = smd 1.27 x 1.27: PP 0,0
2X05M-JTAG = drill 0.914 square: 1 -4,-0.8 | drill 0.914 round: 2 -4,1.2; 3 -2,-1.2; 4 -2,0.8; 5 0,-0.8; 6 0,1.2; 7 2,-1.2; 8 2,0.8; 9 4,-0.8; 10 4,1.2
MC6-G = drill 1.3 long: 1 -9.525,0; 2 -5.715,0; 3 -1.905,0; 4 1.905,0; 5 5.715,0; 6 9.525,0
F09HP = drill 1 octagon: 1 -5.486,-1.27; 2 -2.743,-1.27; 3 0,-1.27; 4 2.743,-1.27; 5 5.486,-1.27; 6 -4.115,1.27; 7 -1.372,1.27; 8 1.372,1.27; 9 4.115,1.27 | drill 3.3 pad 5.08 round: G1 -12.522,0; G2 12.522,0
MC8-G = drill 1.3 long: 1 -13.335,0; 2 -9.525,0; 3 -5.715,0; 4 -1.905,0; 5 1.905,0; 6 5.715,0; 7 9.525,0; 8 13.335,0

### Placement (x,y rotation side)
C1  -81.28,83.82 0 top  (outside the outline)
C2  -85.09,83.82 0 top  (outside the outline)
C3  -88.9,83.82 0 top  (outside the outline)
C4  -92.71,83.82 0 top  (outside the outline)
C5  -96.52,83.82 0 top  (outside the outline)
C6  -100.33,83.82 0 top  (outside the outline)
C7  -15.24,91.44 0 top  (outside the outline)
C8  81.28,72.39 180 top
C9  81.28,70.8 0 top
C10  84.45,70.8 180 top
C11  84.45,72.39 180 top
C12  78.11,81.28 270 top
C13  54.93,51.44 270 top
C14  68.26,32.7 0 top
C15  71.44,32.7 180 top
C16  74.61,32.7 180 top
C17  65.09,32.7 0 top
C18  -57.15,91.44 0 top  (outside the outline)
C19  51.44,32.07 90 top
C20  63.82,81.92 270 top
C21  58.1,81.92 90 top
C22  53.66,81.92 270 top
C23  82.55,20.32 0 top
C24  47.94,81.92 90 top
C25  92.71,60.33 0 top
C26  34.92,50.16 90 top
C27  14.61,35.56 90 top
C28  27.94,34.29 0 top
C29  27.94,21.59 0 top
C30  23.5,28.57 90 top
C31  13.97,22.23 270 top
D1  60.96,81.92 180 top
D2  50.8,81.92 180 top
D3  36.83,5.08 90 top
D4  41.27,5.08 90 top
D5  28.57,27.94 0 top
F1  38.1,15.24 90 top
IC1  93.34,24.77 0 top
IC2  76.2,50.8 90 top
IC3  84.45,77.47 0 top
IC4  56.52,46.99 270 top
IC5  18.41,27.3 90 top
J1  93.34,7.62 0 top
J2  71.75,7.62 0 top
JP1  -15.24,105.41 0 top  (outside the outline)
JP2  terminator  [1X02M']  -87.63,74.93 0 top  (outside the outline)
L1  -83.82,91.44 0 top  (outside the outline)
L2  19.68,34.29 180 top
LED1  -53.34,83.82 0 top  (outside the outline)
LED2  -57.15,83.82 0 top  (outside the outline)
LED3  -49.53,83.82 0 top  (outside the outline)
LED4  -60.96,83.82 0 top  (outside the outline)
LED5  14.61,40.01 180 top
OK1  62.23,73.03 180 top
OK2  57.15,73.03 180 top
OK3  52.07,73.03 180 top
OK4  46.99,73.03 180 top
OK5  31.75,73.03 0 top
OK6  26.67,73.03 0 top
OK7  21.59,73.03 0 top
OK8  16.51,73.03 0 top
Q1  69.85,36.2 0 top
Q2  64.14,29.84 270 top
R1  -87.63,91.44 0 top  (outside the outline)
R2  58.1,51.44 90 top
R3  56.52,51.44 90 top
R4  54.61,39.37 180 top
R5  53.02,32.07 90 top
R6  -19.05,96.52 0 top  (outside the outline)
R7  54.61,32.07 90 top
R8  58.74,32.07 270 top
R9  56.52,32.07 90 top
R10  -34.29,96.52 0 top  (outside the outline)
R11  60.33,32.07 90 top
R12  -41.91,96.52 0 top  (outside the outline)
R13  62.55,84.77 180 top
R14  -57.15,96.52 0 top  (outside the outline)
R15  -60.96,96.52 0 top  (outside the outline)
R16  -80.01,96.52 0 top  (outside the outline)
R17  -83.82,96.52 0 top  (outside the outline)
R18  -72.39,96.52 0 top  (outside the outline)
R19  59.37,84.77 0 top
R20  -68.58,96.52 0 top  (outside the outline)
R21  66.67,20.32 0 top
R22  59.69,17.14 0 top
R23  87,20.32 0 top
R24  52.39,84.77 180 top
R25  -87.63,96.52 0 top  (outside the outline)
R26  -91.44,96.52 0 top  (outside the outline)
R27  -22.86,101.6 0 top  (outside the outline)
R28  -26.67,101.6 0 top  (outside the outline)
R29  -15.24,101.6 0 top  (outside the outline)
R30  49.21,84.77 0 top
R31  -99.06,96.52 0 top  (outside the outline)
R32  30.48,84.45 270 top
R33  -49.53,101.6 0 top  (outside the outline)
R34  25.4,84.45 270 top
R35  -53.34,101.6 0 top  (outside the outline)
R36  20.32,84.45 270 top
R37  -57.15,101.6 0 top  (outside the outline)
R38  15.24,84.45 270 top
R39  -64.77,101.6 0 top  (outside the outline)
R40  17.14,22.23 90 top
R41  19.05,22.23 90 top
R42  20.95,22.23 90 top
R43  19.05,40.01 0 top
R44  13.34,31.75 270 top
R45  14.92,31.75 90 top
S1  -97.79,66.04 0 top  (outside the outline)
TP1  -77.47,100.33 0 top  (outside the outline)
TP2  -81.28,100.33 0 top  (outside the outline)
TP3  75.56,38.73 0 top
TP4  63.5,34.29 0 top
TP5  -92.71,100.33 0 top  (outside the outline)
TP6  -96.52,100.33 0 top  (outside the outline)
TP7  -100.33,100.33 0 top  (outside the outline)
TR1  103.5,26.67 0 top
TR2  104.78,20.32 0 top
TR3  38.1,23.5 90 top
X1  55.88,36.2 0 top
X2  54.61,92.08 180 top
X3  85.09,88.27 0 top
X4  24.13,92.08 180 top

### Tracks (layer width: path | path; a pad name or v marks a point on that pad's centre or on a via)
!RST  (via drill 0.5)  (5 unrouted)
  Top 0.254: R4.1 55.37,37.9 X1.6 | IC2.7 75.45,40.76 v75.88,40.32
  Bottom 0.254: v75.88,40.32 65.09,40.32 62.87,38.1
+3V3  (26 unrouted)
  Top 0.2: 56.52,36.43 55.24,36.43
  Top 0.254: X1.7 57.88,35.15 56.52,36.43 | 55.24,36.43 54.44,36.43 X1.4 53.85,37.03 R4.2
  Top 0.305: C12.2 79.98,80.52 IC3.16
  Top 0.406: IC4.8 59.59,51.54 58.93,52.2 R2.2 R3.2 C13.1 | C19.1 R5.1 R7.1 R9.1 57.78,31.3 | 57.78,31.3 R8.2 R11.1 | X1.7 57.88,33.91 57.63,33.66 57.63,31.46 57.78,31.3
BOOT0  (1 unrouted)
BOOT1  (1 unrouted)
BUS_12V  (5 unrouted)
CAN_CTRL  (2 unrouted)
CAN_H  (3 unrouted)
CAN_L  (3 unrouted)
CANRX  (1 unrouted)
CANTX  (1 unrouted)
COMI12
  Top 0.406: D1.3 OK1.2 60.96,76.2 60.33,75.56 56.52,75.56 55.88,76.2 OK2.2 55.88,87.63 54.61,88.9 54.61,94.61 55.24,95.25 58.42,95.25 60.33,93.34 X2.2 | C21.1 60.62,81.15 D1.3 | C20.2 61.3,81.15 D1.3
COMI34
  Top 0.406: D2.3 OK3.2 50.8,76.2 50.16,75.56 46.35,75.56 45.72,76.2 OK4.2 45.72,87 43.18,89.53 43.18,94.61 43.81,95.25 46.99,95.25 48.9,93.34 X2.5 | C22.2 51.14,81.15 D2.3 | C24.1 50.46,81.15 D2.3
CTS1  (via drill 0.5)
  Top 0.305: IC2.44 74.45,73.81 v77.47,76.83 | v78.42,78.42 78.74,78.11 84.45,78.11 85.09,78.74 IC3.12
  Bottom 0.305: v77.47,76.83 v78.42,78.42
GND  (18 unrouted)
  pour Top (isolate 0.406): -0.64,100.33 118.11,100.33 118.11,-5.08 -0.64,-5.08
I_IN1  (1 unrouted)
I_IN2  (1 unrouted)
I_IN3  (1 unrouted)
I_IN4  (1 unrouted)
I_OUT3  (1 unrouted)
IN1
  Top 0.406: R13.1 63.31,88.71 64.14,89.53 X2.1
IN2
  Top 0.406: R19.1 58.61,87.44 56.52,89.53 X2.3
IN3
  Top 0.406: R24.1 53.15,89.09 52.7,89.53 X2.4
IN4
  Top 0.406: R30.1 48.45,86.17 45.09,89.53 X2.6
JCAN_H  (2 unrouted)
JCAN_L  (2 unrouted)
JNTRST  (1 unrouted)
  Top 0.254: R8.1 58.74,33.34 59.05,33.66 59.05,34.29 58.74,35.88 57.88,36.73 X1.8
JTCK
  Top 0.254: R5.2 53.02,33.34 51.88,34.48 X1.1
JTDI
  Top 0.254: R11.2 60.33,34.95 X1.9
JTDO  (1 unrouted)
  Top 0.254: R7.2 54.61,34.27 X1.3
JTMS
  Top 0.254: R9.2 56.52,34.76 X1.5
N$3  (2 unrouted)
N$4
  Top 0.406: OK1.1 63.5,78.74 64.77,80.01 64.77,82.23 64.33,82.68 C20.1 62.25,82.68 D1.1 61.78,83.14 R13.2
N$5  (2 unrouted)
N$6
  Top 0.406: OK2.1 58.42,78.74 57.15,80.01 57.15,82.23 57.59,82.68 C21.2 59.67,82.68 D1.2 60.13,83.14 R19.2
N$7  (2 unrouted)
N$8  (1 unrouted)
N$9
  Top 0.406: OK3.1 53.34,78.74 54.61,80.01 54.61,82.23 54.17,82.68 C22.1 52.09,82.68 D2.1 51.63,83.14 R24.2
N$10  (2 unrouted)
N$11
  Top 0.406: OK4.1 48.26,78.74 46.99,80.01 46.99,82.23 47.43,82.68 C24.2 49.51,82.68 D2.2 49.97,83.14 R30.2
N$12  (1 unrouted)
N$13  (1 unrouted)
N$14
  Top 0.305: IC5.3 23.37,27.94 C30.1
N$15
  Top 0.61: L2.1 18.41,30.48 18.41,27.3 19.05,26.67 IC5.2 24.68,26.67 D5.C
N$16
  Top 0.305: R44.2 R45.1 15.81,30.1 IC5.5
N$17
  Top 0.61: 19.05,25.4 IC5.8 IC5.7 | 19.05,25.4 IC5.1 20.95,25.4 | 19.05,23.5 R41.2 R40.2 | 19.05,23.5 19.05,25.4 | R42.2 19.3,23.24 19.05,23.5
N$18  (2 unrouted)
N$19
  Top 0.305: X3.4 87.83,90.6 87.63,90.81 81.28,90.81 80.97,90.5 X3.6 80.97,88.37 X3.1
N$21  (1 unrouted)
N$22
  Top 0.406: OK5.3 33.02,82.55 39.37,88.9 39.37,94.61 38.73,95.25 34.29,95.25 33.66,94.61 X4.2
N$23
  Top 0.406: R32.1 33.4,85.47 37.47,89.53 X4.1
N$24
  Top 0.406: OK5.4 R32.2
N$25
  Top 0.406: OK6.4 R34.2
N$26
  Top 0.406: OK6.3 27.94,85.72 31.75,89.53 31.75,94.61 31.11,95.25 26.67,95.25 26.04,94.61 X4.4
N$27
  Top 0.406: R34.1 25.4,86.36 29.84,90.81 X4.3
N$28
  Top 0.406: OK7.3 22.86,87.63 24.13,88.9 24.13,94.61 23.5,95.25 19.05,95.25 18.41,94.61 X4.6
N$29
  Top 0.406: R36.1 20.32,87 22.23,88.9 X4.5
N$30
  Top 0.406: OK7.4 R36.2
N$31
  Top 0.406: R38.1 15.24,88.27 14.61,88.9 X4.7
N$32  (1 unrouted)
N$33  (1 unrouted)
N$34  (1 unrouted)
N$35
  Top 0.406: OK8.3 17.78,88.27 16.51,89.53 16.51,94.61 15.88,95.25 11.43,95.25 10.79,94.61 X4.8
N$36
  Top 0.406: OK8.4 R38.2
N$37  (1 unrouted)
N$38  (2 unrouted)
N$39  (1 unrouted)
N$40  (4 unrouted)
N$44  (2 unrouted)
N$57  (1 unrouted)
N$58  (1 unrouted)
N$80
  Top 0.305: IC3.2 81.28,71.56 C9.1
N$81
  Top 0.305: C10.1 86.04,70.8 86.36,71.12 IC3.6
N$82
  Top 0.305: IC3.5 85.09,72.52 C11.1
N$83
  Top 0.305: IC3.4 83.82,72.52 C11.2
N$84
  Top 0.305: IC3.3 82.55,72.9 C8.1
N$85
  Top 0.305: IC3.1 80.01,72.9 C8.2
OSC32_IN
  Top 0.254: IC2.3 73.45,39.8 72.39,38.73 70.48,38.73 69.85,38.1 66.04,38.1 65.41,37.47 65.41,36.2 64.77,35.56 62.87,35.56 62.23,34.92 62.23,33.66 62.87,33.02 62.87,29.84 Q2.2
  Top 0.305: C16.1 75.37,31.56 74.61,30.8 66.36,30.8 Q2.2
OSC32_OUT
  Top 0.254: IC2.4 73.95,39.02 73.03,38.1 71.12,38.1 70.48,37.47 66.67,37.47 66.04,36.83 66.04,34.92 65.41,34.29 | Q2.1 64.33,31.3 C17.1 64.33,33.21 65.41,34.29 | 65.41,34.29 TP4.PP
OSC_IN
  Top 0.254: IC2.5 74.45,38.26 73.66,37.47 71.75,37.47 70.48,36.2 Q1.1 67.5,36.13 C14.1
OSC_OUT
  Top 0.254: 74.95,38.73 74.95,37.48 73.66,36.2 Q1.2 72.2,36.13 C15.1 | 74.95,38.73 IC2.6 | 74.95,38.73 TP3.PP
RS232-CTS
  Top 0.305: IC3.13 83.82,89.43 X3.7
RS232-RTS
  Top 0.305: IC3.7 87.63,73.03 88.27,72.39 90.17,72.39 91.44,73.66 91.44,83.19 90.81,83.82 87,83.82 86.36,84.45 86.36,89.43 X3.8
RS232-RXD
  Top 0.305: IC3.8 90.27,74.4 90.81,74.93 90.81,82.55 90.17,83.19 85.72,83.19 85.09,83.82 X3.3
RS232-TXD
  Top 0.305: IC3.14 82.55,86.79 X3.2
RS485+  (1 unrouted)
RS485-  (1 unrouted)
RTS1
  Top 0.305: IC2.45 73.95,74.58 77.15,77.79 77.47,77.79 78.42,77.47 86.36,77.47 87.63,78.74 IC3.10
RXD1
  Top 0.305: IC2.43 74.95,73.05 78.74,76.83 87,76.83 88.9,78.74 IC3.9
SCL1  (2 unrouted)
  Top 0.254: IC4.6 58.42,46.35 57.78,46.99 57.78,49.53 58.1,49.85 R2.1
SDA1  (2 unrouted)
  Top 0.254: IC4.5 58.42,45.09 56.52,46.99 R3.1
TXD1
  Top 0.305: IC2.42 75.45,72.28 79.38,76.2 87.63,76.2 90.17,78.74 90.17,81.92 89.53,82.55 87,82.55 86.36,81.92 IC3.11
VBAT  (2 unrouted)
VDDA  (3 unrouted)
VPOW  (5 unrouted)
  Top 0.61: R40.1 16.26,21.21 15.56,21.91 15.56,22.54 14.86,23.24 C31.1 13.97,27.3 14.61,27.94 IC5.6